# Altium schematic sheet P10 PR2000K_MIPI.SchDoc
size 420 x 297 mm
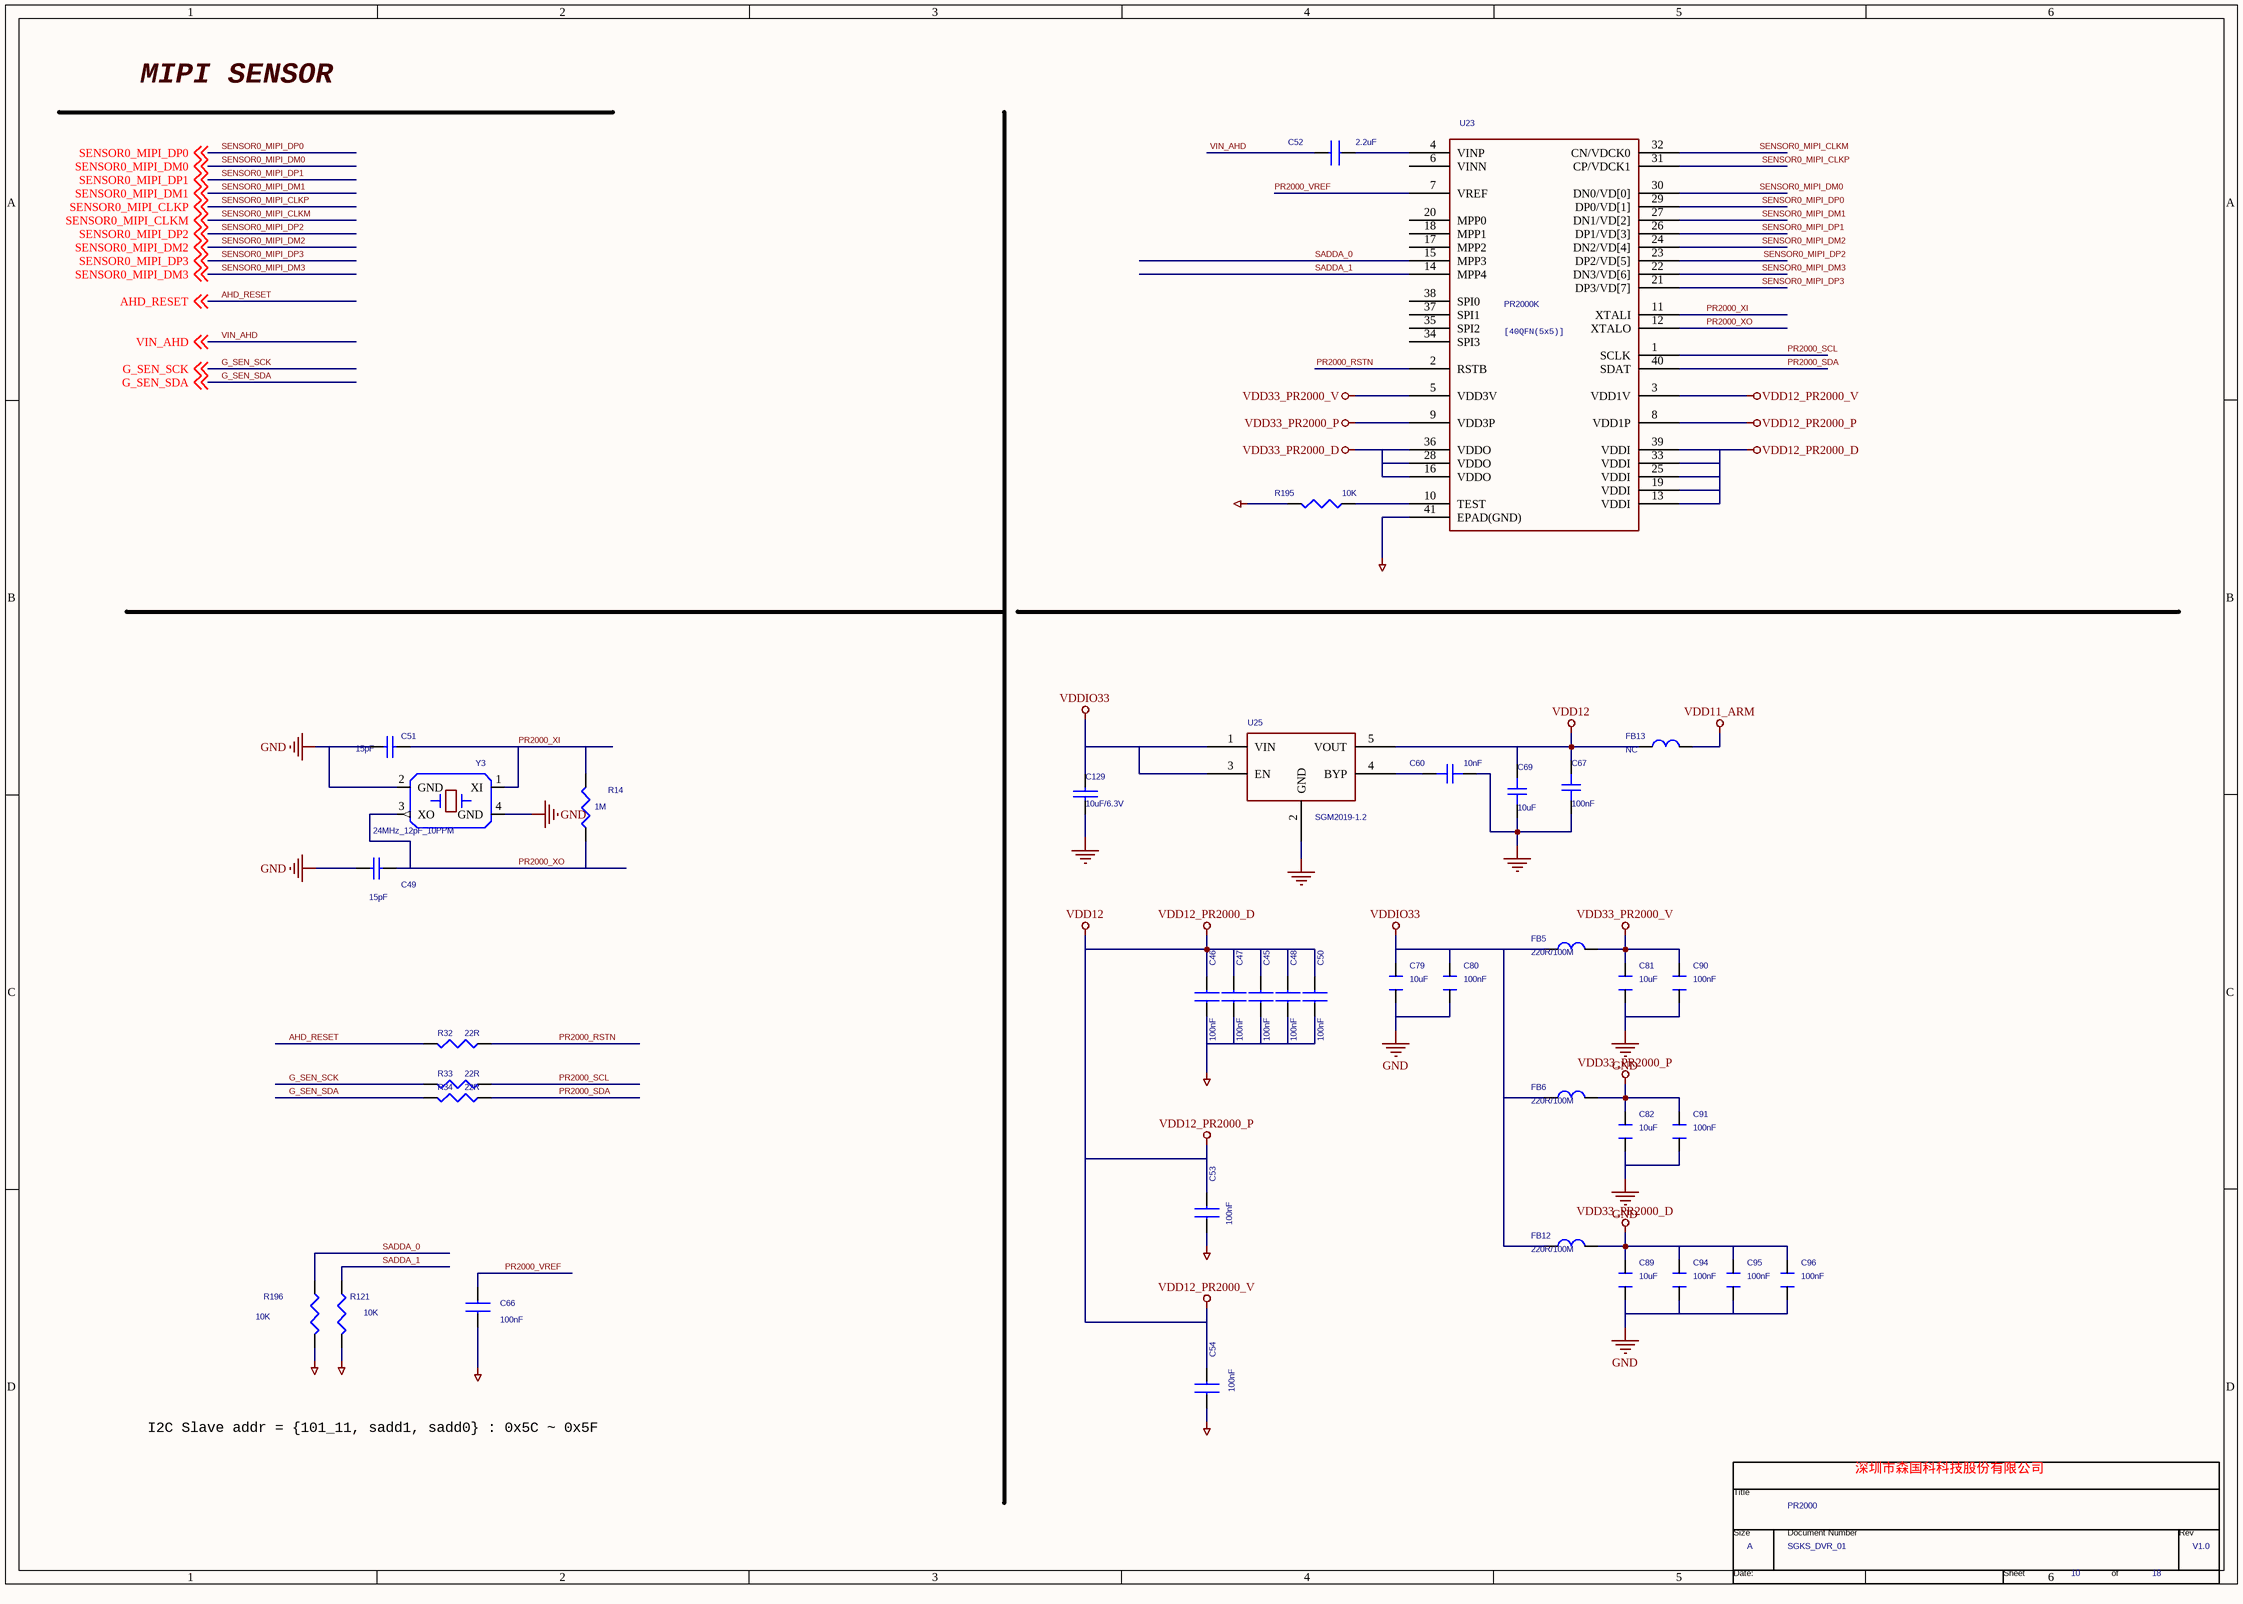
[diagram p0: P10 PR2000K_MIPI.SchDoc]

## Parts
*  Page Count: 18  Page Number: 10  Page Size: A  Title: PR2000  RevCode: V1.0  Doc: SGKS_DVR_01  (hidden comment: TitleBlock0)  (graphical)
C45  100nF  [C0603]
C46  100nF  [C0603]
C47  100nF  [C0603]
C48  100nF  [C0603]
C49  15pF  [C0402]
C50  100nF  [C0603]
C51  15pF  [C0402]
C52  2.2uF  [C0603]
C53  100nF  [C0603]
C54  100nF  [C0603]
C60  10nF  [0402C]
C66  100nF  [C0603]
C67  100nF  [0402C]
C69  10uF  [0603C]
C79  10uF  [C0603]
C80  100nF  [C0402]
C81  10uF  [C0603]
C82  10uF  [C0603]
C89  10uF  [C0603]
C90  100nF  [C0402]
C91  100nF  [C0402]
C94  100nF  [C0402]
C95  100nF  [C0402]
C96  100nF  [C0402]
C129  10uF/6.3V  [1206C]
FB5  220R/100M  [0805]
FB6  220R/100M  [0805]
FB12  220R/100M  [0805]
FB13  NC  [0805]
R14  1M  [R0603/SMD]
R32  22R  [R0603/SMD]
R33  22R  [R0603/SMD]
R34  22R  [R0603/SMD]
R121  10K  [R1005]
R195  10K  [R1005]
R196  10K  [R1005]
U23  PR2000K  [QFN40_PR2000]
U25  SGM2019-1.2  [SOT23-5]
Y3  24MHz_12pF_10PPM  [OSC4_SMD_50X32]

## Nets
GND: C45.1 C46.1 C47.1 C48.1 C49.2 C50.1 C51.2 C53.1 C54.1 C60.2 C66.1 C67.2 C69.2 C79.1 C80.1 C81.1 C82.1 C89.1 C90.1 C91.1 C94.1 C95.1 C96.1 C129.2 R121.1 R195.2 R196.1 U23.41(EPAD(GND)) U25.2(GND) Y3.2(GND) Y3.4(GND)
VDD11_ARM: FB13.2
VDD12: C45.2 C46.2 C47.2 C48.2 C50.2 C53.2 C54.2 C67.1 C69.1 FB13.1 U23.3(VDD1V) U23.8(VDD1P) U23.13(VDDI) U23.19(VDDI) U23.25(VDDI) U23.33(VDDI) U23.39(VDDI) U25.5(VOUT)  [also labelled VDD12_PR2000_D, VDD12_PR2000_P, VDD12_PR2000_V]
VDD33_PR2000_D: C89.2 C94.2 C95.2 C96.2 FB12.2 U23.16(VDDO) U23.28(VDDO) U23.36(VDDO)
VDD33_PR2000_P: C82.2 C91.2 FB6.2 U23.9(VDD3P)
VDD33_PR2000_V: C81.2 C90.2 FB5.2 U23.5(VDD3V)
VDDIO33: C79.2 C80.2 C129.1 FB5.1 FB6.1 FB12.1 U25.1(VIN) U25.3(EN)
AHD_RESET: R32.2 ; off-sheet AHD_RESET
G_SEN_SCK: R33.2 ; off-sheet G_SEN_SCK
G_SEN_SDA: R34.2 ; off-sheet G_SEN_SDA
PR2000_RSTN: R32.1 U23.2(RSTB)
PR2000_SCL: R33.1 U23.1(SCLK)
PR2000_SDA: R34.1 U23.40(SDAT)
PR2000_VREF: C66.2 U23.7(VREF)
PR2000_XI: C51.1 R14.1 U23.11(XTALI) Y3.1(XI)
PR2000_XO: C49.1 R14.2 U23.12(XTALO) Y3.3(XO)
SADDA_0: R196.2 U23.15(MPP3)
SADDA_1: R121.2 U23.14(MPP4)
SENSOR0_MIPI_CLKM: U23.32(CN/VDCK0) ; off-sheet SENSOR0_MIPI_CLKM
SENSOR0_MIPI_CLKP: U23.31(CP/VDCK1) ; off-sheet SENSOR0_MIPI_CLKP
SENSOR0_MIPI_DM0: U23.30(DN0/VD[0]) ; off-sheet SENSOR0_MIPI_DM0
SENSOR0_MIPI_DM1: U23.27(DN1/VD[2]) ; off-sheet SENSOR0_MIPI_DM1
SENSOR0_MIPI_DM2: U23.24(DN2/VD[4]) ; off-sheet SENSOR0_MIPI_DM2
SENSOR0_MIPI_DM3: U23.22(DN3/VD[6]) ; off-sheet SENSOR0_MIPI_DM3
SENSOR0_MIPI_DP0: U23.29(DP0/VD[1]) ; off-sheet SENSOR0_MIPI_DP0
SENSOR0_MIPI_DP1: U23.26(DP1/VD[3]) ; off-sheet SENSOR0_MIPI_DP1
SENSOR0_MIPI_DP2: U23.23(DP2/VD[5]) ; off-sheet SENSOR0_MIPI_DP2
SENSOR0_MIPI_DP3: U23.21(DP3/VD[7]) ; off-sheet SENSOR0_MIPI_DP3
VIN_AHD: C52.1 ; off-sheet VIN_AHD
NetC52_2: C52.2 U23.4(VINP)
NetC60_1: C60.1 U25.4(BYP)
NetR195_1: R195.1 U23.10(TEST)

Not connected (* = marked no-connect by the designer): U23 6(VINN) 17(MPP2) 18(MPP1) 20(MPP0) 34(SPI3) 35(SPI2) 37(SPI1) 38(SPI0)

## Notes on the sheet
- MIPI SENSOR
- I2C Slave addr = {101_11, sadd1, sadd0} : 0x5C ~ 0x5F
- 深圳市森国科科技股份有限公司
- (in symbol PR2000K_0) [40QFN(5x5)]
- (in symbol TitleBlock0) Title; Size; Document Number; Rev; Date:; Sheet; of

## Library data of the parts
C45-C48 C50 C52-C54 C66 = CAP NP_1: ROOM: CHG
C49 C51 = CAP/CB_0: Part Description: Chip Capacitor
C60 = 1210_10nF10%-0402-X7R-50V: Part1: 电容-10nF±10%-0402-X7R-50V; Part2: A.01.02.01.210
C67 = 1241_100nF10%-0402-X7R-16V: Part1: 电容-100nF±10%-0402-X7R-16V; ROOM: XM310; Part2: A.01.02.01.241
C69 = 1341_10uF20%-0603-X5R-6.3V: Part1: 电容-10uF±20%-0603-X5R-6.3V; ROOM: 3.3V_AVDD; Part2: A.01.02.01.341
C79-C82 C89-C91 C94-C96 = CAPACITOR: PAGE: 1
C129 = 10uF+80%/-20%-1206-Y5V-25V: Part1: 电容-10uF+80%/-20%-1206-Y5V-25V; Part2: A.02.04.01.202
FB5 FB6 FB12 FB13 = Ferrite BEAD
R14 R32-R34 = RES/SMD_0: Part Description: Chip Resistor
R121 R195 R196 = R1005_0
U23 = PR2000K_0
U25 = 2101_BL9193-3.3-SOT23-5: Part1: 集成电路-BL9193-33-A-A-X-RN-3.3VLDO-200mA-(SOT23-5); ROOM: 3.3V_AVDD; Part2: A.01.08.02.101
Y3 = CRYSTAL/4P: Type: 贴片晶振?
* = TitleBlock0: Page Create Date: March  8, 1995